# Altium schematic sheet EMG_connectors_and_filters_CH_1_4.SchDoc: EMG_connectors_and_filters_CH_1_4
size B; Organization: Myomo; Address1: 137 PORTLAND STREET, 4TH FLOOR; Address2: BOSTON, MA 02114; Address3: USA; SheetNumber: 5
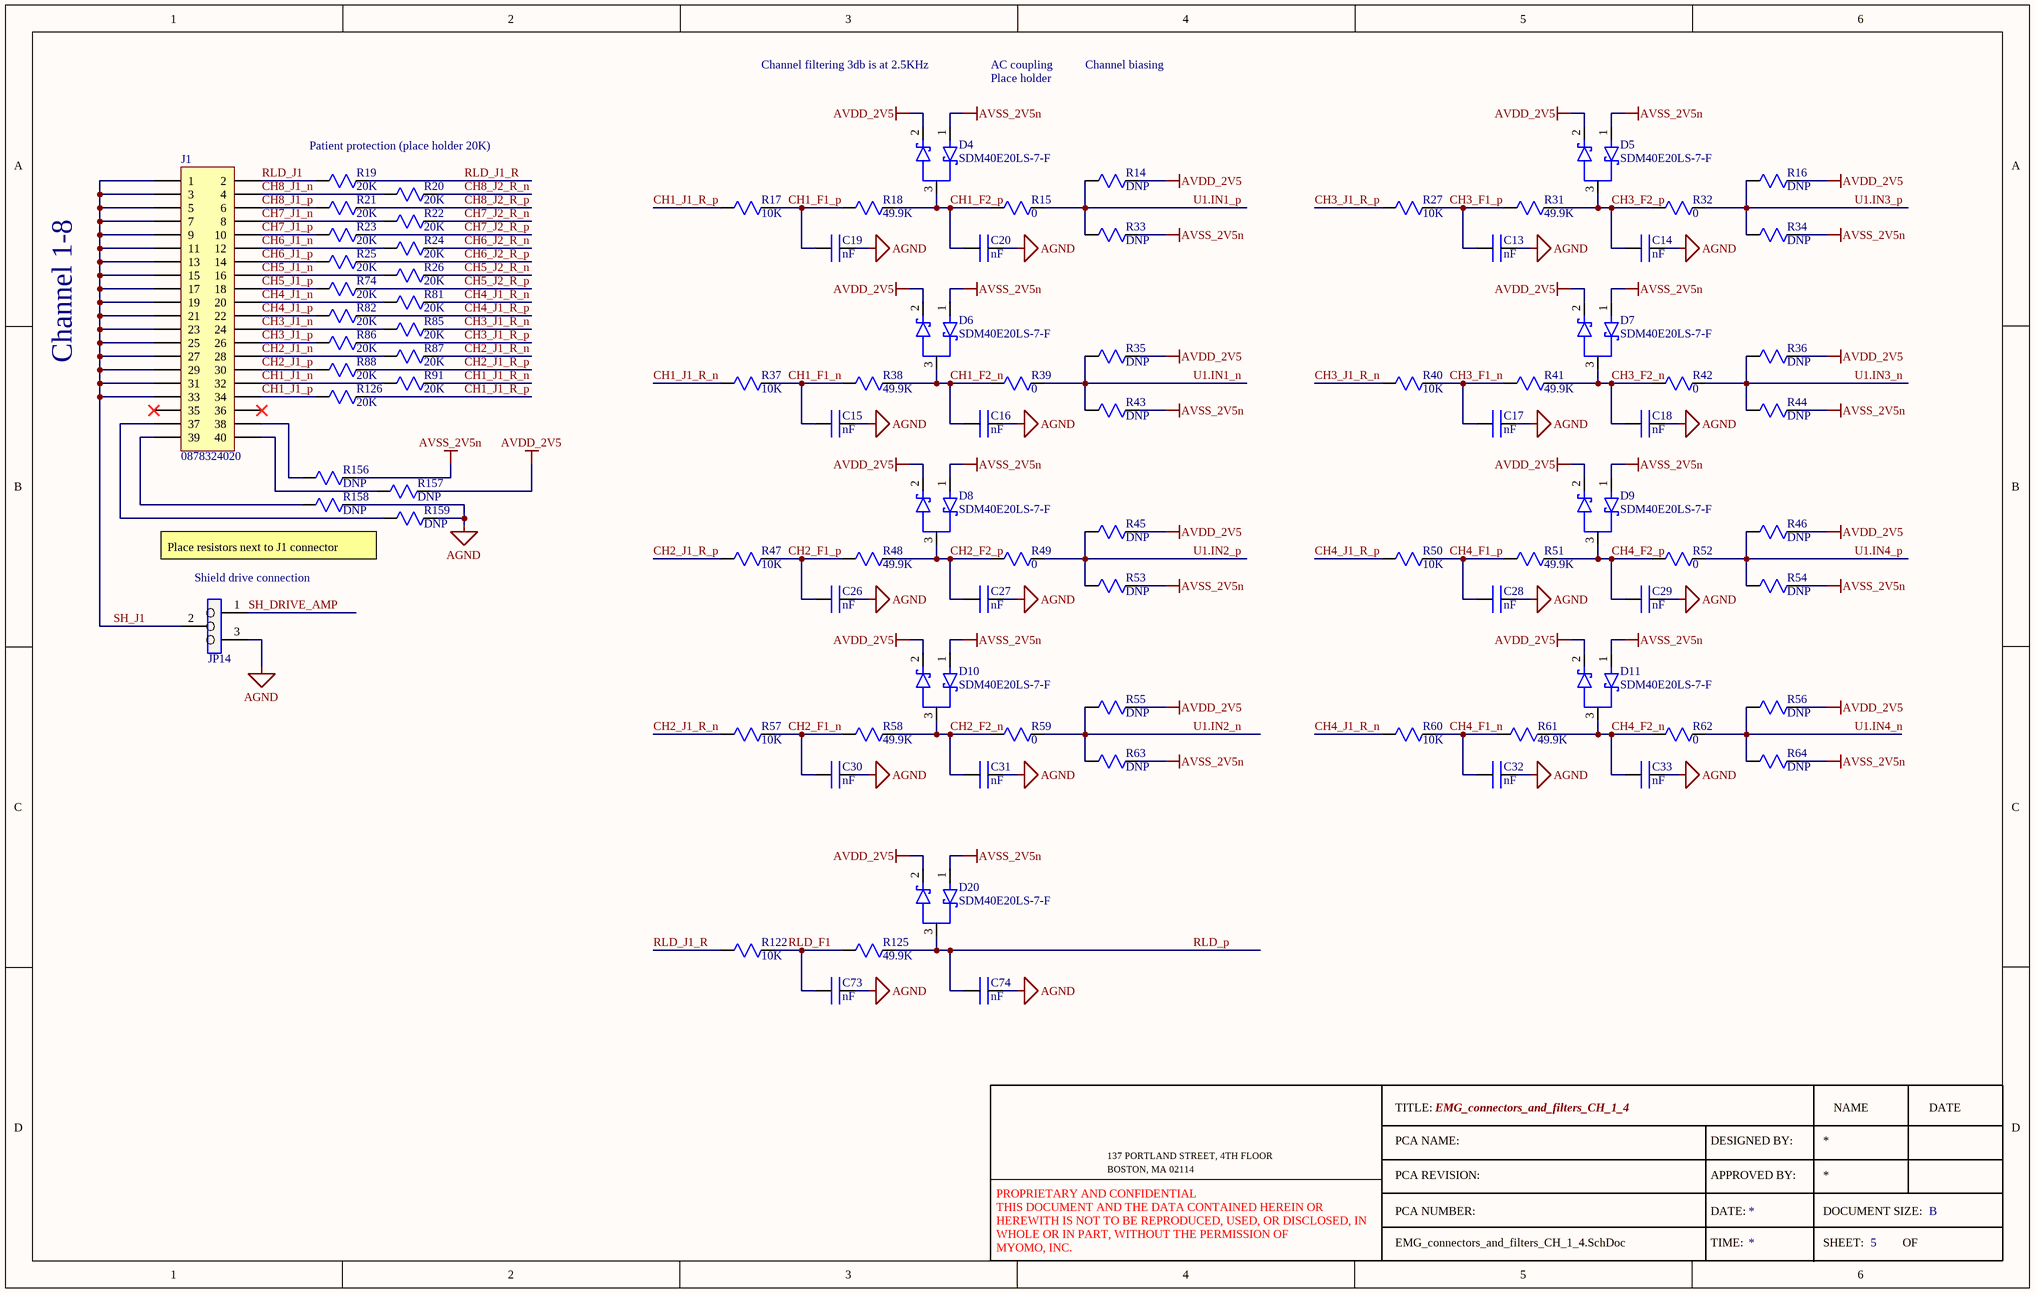
[diagram p0: EMG_connectors_and_filters_CH_1_4.SchDoc]

## Parts
C13  nF  [0402]
C14  nF  [0402]
C15  nF  [0402]
C16  nF  [0402]
C17  nF  [0402]
C18  nF  [0402]
C19  nF  [0402]
C20  nF  [0402]
C26  nF  [0402]
C27  nF  [0402]
C28  nF  [0402]
C29  nF  [0402]
C30  nF  [0402]
C31  nF  [0402]
C32  nF  [0402]
C33  nF  [0402]
C73  nF  [0402]
C74  nF  [0402]
D4  SDM40E20LS-7-F  [D_SCHOTT_0.31mV_400mA]
D5  SDM40E20LS-7-F  [D_SCHOTT_0.31mV_400mA]
D6  SDM40E20LS-7-F  [D_SCHOTT_0.31mV_400mA]
D7  SDM40E20LS-7-F  [D_SCHOTT_0.31mV_400mA]
D8  SDM40E20LS-7-F  [D_SCHOTT_0.31mV_400mA]
D9  SDM40E20LS-7-F  [D_SCHOTT_0.31mV_400mA]
D10  SDM40E20LS-7-F  [D_SCHOTT_0.31mV_400mA]
D11  SDM40E20LS-7-F  [D_SCHOTT_0.31mV_400mA]
D20  SDM40E20LS-7-F  [D_SCHOTT_0.31mV_400mA]
J1  0878324020  [J_MOLEX_0878324020]
JP14  JP_1x3_TSW-103-07-F-S  [JP_1x3_TSW-103-07-F-S]  (value not drawn)
R14  DNP  [0402]  (no BOM)
R15  0  [0402]
R16  DNP  [0402]  (no BOM)
R17  10K  [0402]
R18  49.9K  [0402]
R19  20K  [0603]
R20  20K  [0603]
R21  20K  [0603]
R22  20K  [0603]
R23  20K  [0603]
R24  20K  [0603]
R25  20K  [0603]
R26  20K  [0603]
R27  10K  [0402]
R31  49.9K  [0402]
R32  0  [0402]
R33  DNP  [0402]  (no BOM)
R34  DNP  [0402]  (no BOM)
R35  DNP  [0402]  (no BOM)
R36  DNP  [0402]  (no BOM)
R37  10K  [0402]
R38  49.9K  [0402]
R39  0  [0402]
R40  10K  [0402]
R41  49.9K  [0402]
R42  0  [0402]
R43  DNP  [0402]  (no BOM)
R44  DNP  [0402]  (no BOM)
R45  DNP  [0402]  (no BOM)
R46  DNP  [0402]  (no BOM)
R47  10K  [0402]
R48  49.9K  [0402]
R49  0  [0402]
R50  10K  [0402]
R51  49.9K  [0402]
R52  0  [0402]
R53  DNP  [0402]  (no BOM)
R54  DNP  [0402]  (no BOM)
R55  DNP  [0402]  (no BOM)
R56  DNP  [0402]  (no BOM)
R57  10K  [0402]
R58  49.9K  [0402]
R59  0  [0402]
R60  10K  [0402]
R61  49.9K  [0402]
R62  0  [0402]
R63  DNP  [0402]  (no BOM)
R64  DNP  [0402]  (no BOM)
R74  20K  [0603]
R81  20K  [0603]
R82  20K  [0603]
R85  20K  [0603]
R86  20K  [0603]
R87  20K  [0603]
R88  20K  [0603]
R91  20K  [0603]
R122  10K  [0402]
R125  49.9K  [0402]
R126  20K  [0603]
R156  DNP  [0603]  (no BOM)
R157  DNP  [0603]  (no BOM)
R158  DNP  [0603]  (no BOM)
R159  DNP  [0603]  (no BOM)

## Nets
AGND: C13.2 C14.2 C15.2 C16.2 C17.2 C18.2 C19.2 C20.2 C26.2 C27.2 C28.2 C29.2 C30.2 C31.2 C32.2 C33.2 C73.2 C74.2 JP14.3 R158.2 R159.2
AVDD_2V5: D4.2(A2) D5.2(A2) D6.2(A2) D7.2(A2) D8.2(A2) D9.2(A2) D10.2(A2) D11.2(A2) D20.2(A2) R14.2 R16.2 R35.2 R36.2 R45.2 R46.2 R55.2 R56.2 R157.2
AVSS_2V5n: D4.1(A1) D5.1(A1) D6.1(A1) D7.1(A1) D8.1(A1) D9.1(A1) D10.1(A1) D11.1(A1) D20.1(A1) R33.2 R34.2 R43.2 R44.2 R53.2 R54.2 R63.2 R64.2 R156.2
CH1_F1_n: C15.1 R37.2 R38.1
CH1_F1_p: C19.1 R17.2 R18.1
CH1_F2_n: C16.1 D6.3(K) R38.2 R39.1
CH1_F2_p: C20.1 D4.3(K) R15.1 R18.2
CH1_J1_n: J1.32 R91.1
CH1_J1_p: J1.34 R126.1
CH1_J1_R_n: R37.1 R91.2
CH1_J1_R_p: R17.1 R126.2
CH2_F1_n: C30.1 R57.2 R58.1
CH2_F1_p: C26.1 R47.2 R48.1
CH2_F2_n: C31.1 D10.3(K) R58.2 R59.1
CH2_F2_p: C27.1 D8.3(K) R48.2 R49.1
CH2_J1_n: J1.28 R87.1
CH2_J1_p: J1.30 R88.1
CH2_J1_R_n: R57.1 R87.2
CH2_J1_R_p: R47.1 R88.2
CH3_F1_n: C17.1 R40.2 R41.1
CH3_F1_p: C13.1 R27.2 R31.1
CH3_F2_n: C18.1 D7.3(K) R41.2 R42.1
CH3_F2_p: C14.1 D5.3(K) R31.2 R32.1
CH3_J1_n: J1.24 R85.1
CH3_J1_p: J1.26 R86.1
CH3_J1_R_n: R40.1 R85.2
CH3_J1_R_p: R27.1 R86.2
CH4_F1_n: C32.1 R60.2 R61.1
CH4_F1_p: C28.1 R50.2 R51.1
CH4_F2_n: C33.1 D11.3(K) R61.2 R62.1
CH4_F2_p: C29.1 D9.3(K) R51.2 R52.1
CH4_J1_n: J1.20 R81.1
CH4_J1_p: J1.22 R82.1
CH4_J1_R_n: R60.1 R81.2
CH4_J1_R_p: R50.1 R82.2
CH5_J1_n: J1.16 R26.1
CH5_J1_p: J1.18 R74.1
CH5_J2_R_n: R26.2
CH5_J2_R_p: R74.2
CH6_J1_n: J1.12 R24.1
CH6_J1_p: J1.14 R25.1
CH6_J2_R_n: R24.2
CH6_J2_R_p: R25.2
CH7_J1_n: J1.8 R22.1
CH7_J1_p: J1.10 R23.1
CH7_J2_R_n: R22.2
CH7_J2_R_p: R23.2
CH8_J1_n: J1.4 R20.1
CH8_J1_p: J1.6 R21.1
CH8_J2_R_n: R20.2
CH8_J2_R_p: R21.2
RLD_F1: C73.1 R122.2 R125.1
RLD_J1: J1.2 R19.1
RLD_J1_R: R19.2 R122.1
RLD_p: C74.1 D20.3(K) R125.2
SH_DRIVE_AMP: JP14.1
SH_J1: J1.1 J1.3 J1.5 J1.7 J1.9 J1.11 J1.13 J1.15 J1.17 J1.19 J1.21 J1.23 J1.25 J1.27 J1.29 J1.31 J1.33 JP14.2
U1.IN1_n: R35.1 R39.2 R43.1
U1.IN1_p: R14.1 R15.2 R33.1
U1.IN2_n: R55.1 R59.2 R63.1
U1.IN2_p: R45.1 R49.2 R53.1
U1.IN3_n: R36.1 R42.2 R44.1
U1.IN3_p: R16.1 R32.2 R34.1
U1.IN4_n: R56.1 R62.2 R64.1
U1.IN4_p: R46.1 R52.2 R54.1
NetJ1_37: J1.37 R159.1
NetJ1_38: J1.38 R156.1
NetJ1_39: J1.39 R158.1
NetJ1_40: J1.40 R157.1

Not connected (* = marked no-connect by the designer): J1 35* 36*

## Notes on the sheet
- Channel filtering 3db is at 2.5KHz
- AC coupling
- Place holder
- Channel biasing
- Patient protection (place holder 20K)
- Channel 1-8
- Place resistors next to J1 connector
- (near JP14) Shield drive connection
- TITLE:
- NAME
- DATE
- PCA REVISION:
- PCA NAME:
- APPROVED BY:
- DESIGNED BY:
- PCA NUMBER:
- DATE:
- TIME:
- DOCUMENT SIZE:
- SHEET:
- OF
- B
- PROPRIETARY AND CONFIDENTIAL
  THIS DOCUMENT AND THE DATA CONTAINED HEREIN OR HEREWITH IS NOT TO BE REPRODUCED, USED, OR DISCLOSED, IN WHOLE OR IN PART, WITHOUT THE PERMISSION OF
  MYOMO, INC.

## Library data of the parts
C13-C20 C26-C33 C73 C74 = C_0402_CER_1nF_50V_X7R: CAP CER 1000PF 50V X7R 0402; MFG: Samsung; MFGPN: CL05B102KB5NNNC; Myomo PN: 201-0019
D4-D11 D20 = D_SCHOTT_0.31mV_400mA: DIODE ARR SCHOTT 20V 400MA SOT23; MFG: Diodes Incorporated; Myomo PN: 203-0006; MFGPN: SDM40E20LS-7-F
J1 = J_MOLEX_0878324020: CONN HEADER SMD 40POS 2MM PITCH; MFG: Molex; Myomo PN: 211-0011; MFGPN: 0878324020; ComponentLink1Description: New link; ComponentLink1URL: *
JP14 = JP_1x3_TSW-103-07-F-S: CONN HEADER VERT 2POS 2.54MM; MFG: SAMTEC; Myomo PN: 214-0002; MFGPN: TSW-103-07-F-S
R14 R16 R33-R36 R43-R46 R53-R56 R63 R64 = R_0402_DNP: RES 0402 DNP
R15 R32 R39 R42 R49 R52 R59 R62 = R_0402_0: RES 0 OHM JUMPER 1/10W 0402; MFG: YAGEO; MFGPN: RC0402FR-070RL; Myomo PN: 200-0018
R17 R27 R37 R40 R47 R50 R57 R60 R122 = R_0402_10K_1%_1/10W: RES SMD 10K OHM 1% 1/10W 0402; MFG: Panasonic; MFGPN: ERJ-2RKF1002X; Myomo PN: 200-0021
R18 R31 R38 R41 R48 R51 R58 R61 R125 = R_0402_49.9K_1%_1/10W: RES SMD 49.9 OHM 1% 1/10W 0402; MFG: Panasonic; MFGPN: ERJ-2RKF49R9X; Myomo PN: 200-0027
R19-R26 R74 R81 R82 R85-R88 R91 R126 = R_0603_20K_1%_1/10W: RES 20K OHM 1% 1/10W 0603; MFG: YAGEO; MFGPN: RC0603FR-0720KL; Myomo PN: 200-0026
R156-R159 = R_0603_DNP: RES 0603 DNP